# EAGLE design StackBreakoutConnection (EAGLE 9.1.0)
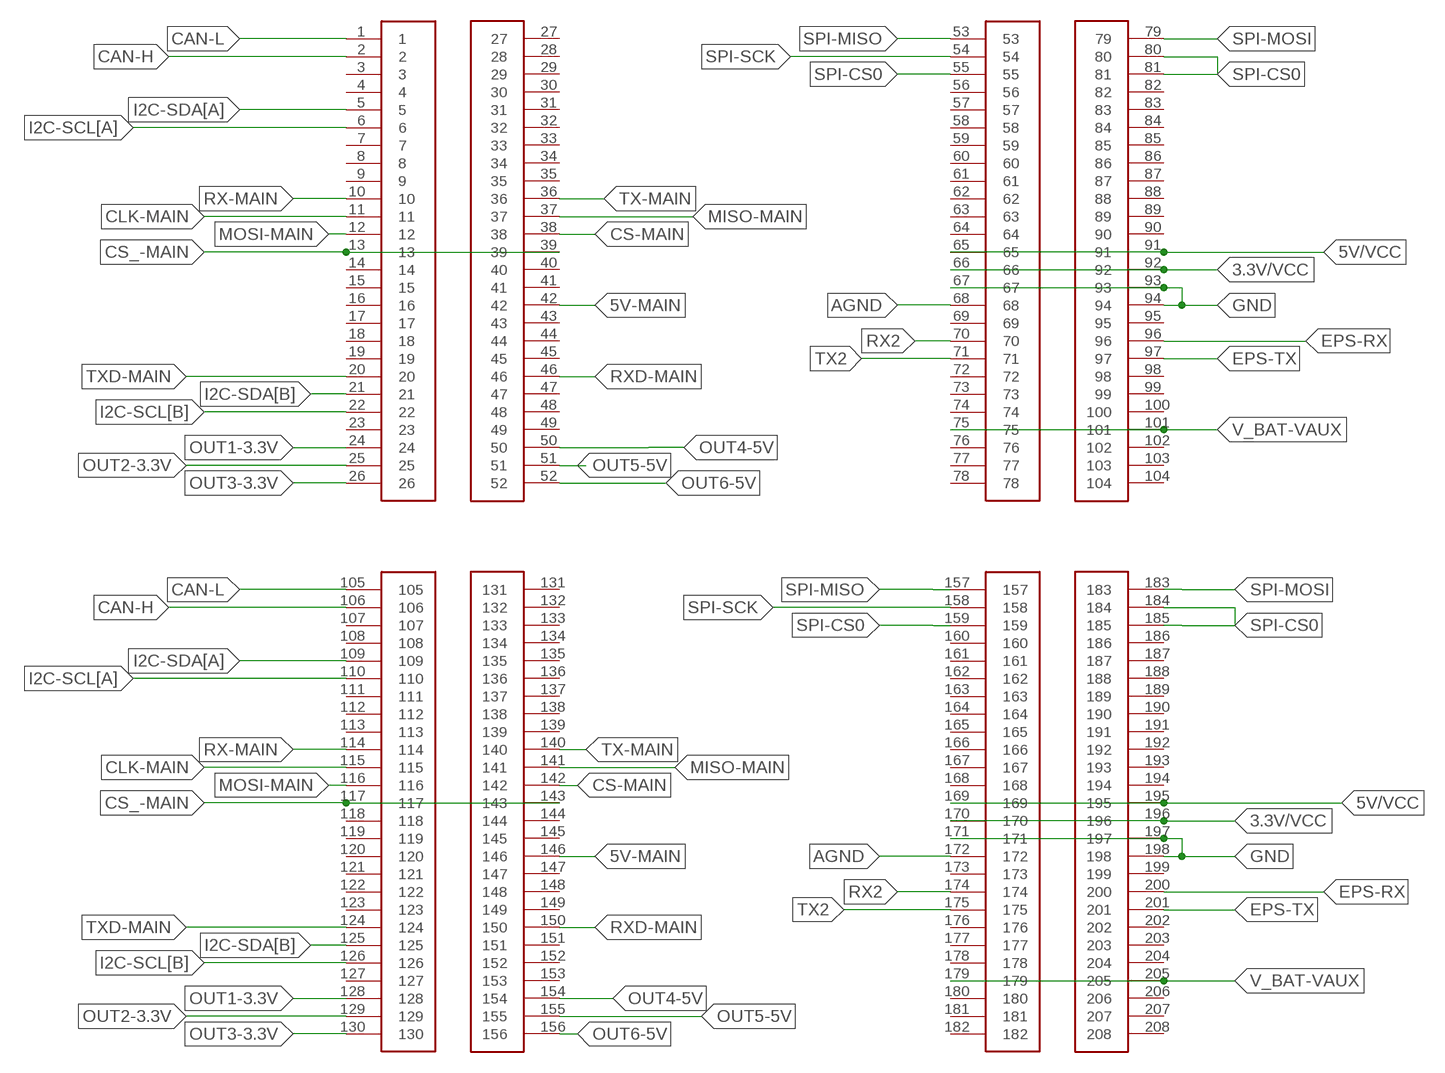
[diagram p0: schematic, sheet 1]

## Parts
U$1  SUCHAI_STACKBREAKOUT  [SUCHAI_STACKBREAKOUT]

## Nets
3.3V/VCC: U$1.66 U$1.92 U$1.170 U$1.196
5V-MAIN: U$1.42 U$1.146
5V/VCC: U$1.65 U$1.91 U$1.169 U$1.195
AGND: U$1.68 U$1.172
CAN-H: U$1.2 U$1.106
CAN-L: U$1.1 U$1.105
CLK-MAIN: U$1.11 U$1.115
CS-MAIN: U$1.38 U$1.142
CS_-MAIN: U$1.13 U$1.39 U$1.117 U$1.143
EPS-RX: U$1.96 U$1.200
EPS-TX: U$1.97 U$1.201
GND: U$1.67 U$1.93 U$1.94 U$1.171 U$1.197 U$1.198
I2C-SCL[A]: U$1.6 U$1.110
I2C-SCL[B]: U$1.22 U$1.126
I2C-SDA[A]: U$1.5 U$1.109
I2C-SDA[B]: U$1.21 U$1.125
MISO-MAIN: U$1.37 U$1.141
MOSI-MAIN: U$1.12 U$1.116
OUT1-3.3V: U$1.24 U$1.128
OUT2-3.3V: U$1.25 U$1.129
OUT3-3.3V: U$1.26 U$1.130
OUT4-5V: U$1.50 U$1.154
OUT5-5V: U$1.51 U$1.155
OUT6-5V: U$1.52 U$1.156
RX2: U$1.70 U$1.174
RX-MAIN: U$1.10 U$1.114
RXD-MAIN: U$1.46 U$1.150
SPI-CS0: U$1.55 U$1.80 U$1.81 U$1.159 U$1.184 U$1.185
SPI-MISO: U$1.53 U$1.157
SPI-MOSI: U$1.79 U$1.183
SPI-SCK: U$1.54 U$1.158
TX2: U$1.71 U$1.175
TX-MAIN: U$1.36 U$1.140
TXD-MAIN: U$1.20 U$1.124
V_BAT-VAUX: U$1.75 U$1.101 U$1.179 U$1.205
Unconnected: U$1.3 U$1.4 U$1.7 U$1.8 U$1.9 U$1.14 U$1.15 U$1.16 U$1.17 U$1.18 U$1.19 U$1.23 U$1.27 U$1.28 U$1.29 U$1.30 U$1.31 U$1.32 U$1.33 U$1.34 U$1.35 U$1.40 U$1.41 U$1.43 U$1.44 U$1.45 U$1.47 U$1.48 U$1.49 U$1.56 U$1.57 U$1.58 U$1.59 U$1.60 U$1.61 U$1.62 U$1.63 U$1.64 U$1.69 U$1.72 U$1.73 U$1.74 U$1.76 U$1.77 U$1.78 U$1.82 U$1.83 U$1.84 U$1.85 U$1.86 U$1.87 U$1.88 U$1.89 U$1.90 U$1.95 U$1.98 U$1.99 U$1.100 U$1.102 U$1.103 U$1.104 U$1.107 U$1.108 U$1.111 U$1.112 U$1.113 U$1.118 U$1.119 U$1.120 U$1.121 U$1.122 U$1.123 U$1.127 U$1.131 U$1.132 U$1.133 U$1.134 U$1.135 U$1.136 U$1.137 U$1.138 U$1.139 U$1.144 U$1.145 U$1.147 U$1.148 U$1.149 U$1.151 U$1.152 U$1.153 U$1.160 U$1.161 U$1.162 U$1.163 U$1.164 U$1.165 U$1.166 U$1.167 U$1.168 U$1.173 U$1.176 U$1.177 U$1.178 U$1.180 U$1.181 U$1.182 U$1.186 U$1.187 U$1.188 U$1.189 U$1.190 U$1.191 U$1.192 U$1.193 U$1.194 U$1.199 U$1.202 U$1.203 U$1.204 U$1.206 U$1.207 U$1.208

## Library data of the parts
U$1 = SUCHAI_PCB:SUCHAI_STACKBREAKOUT

## Board
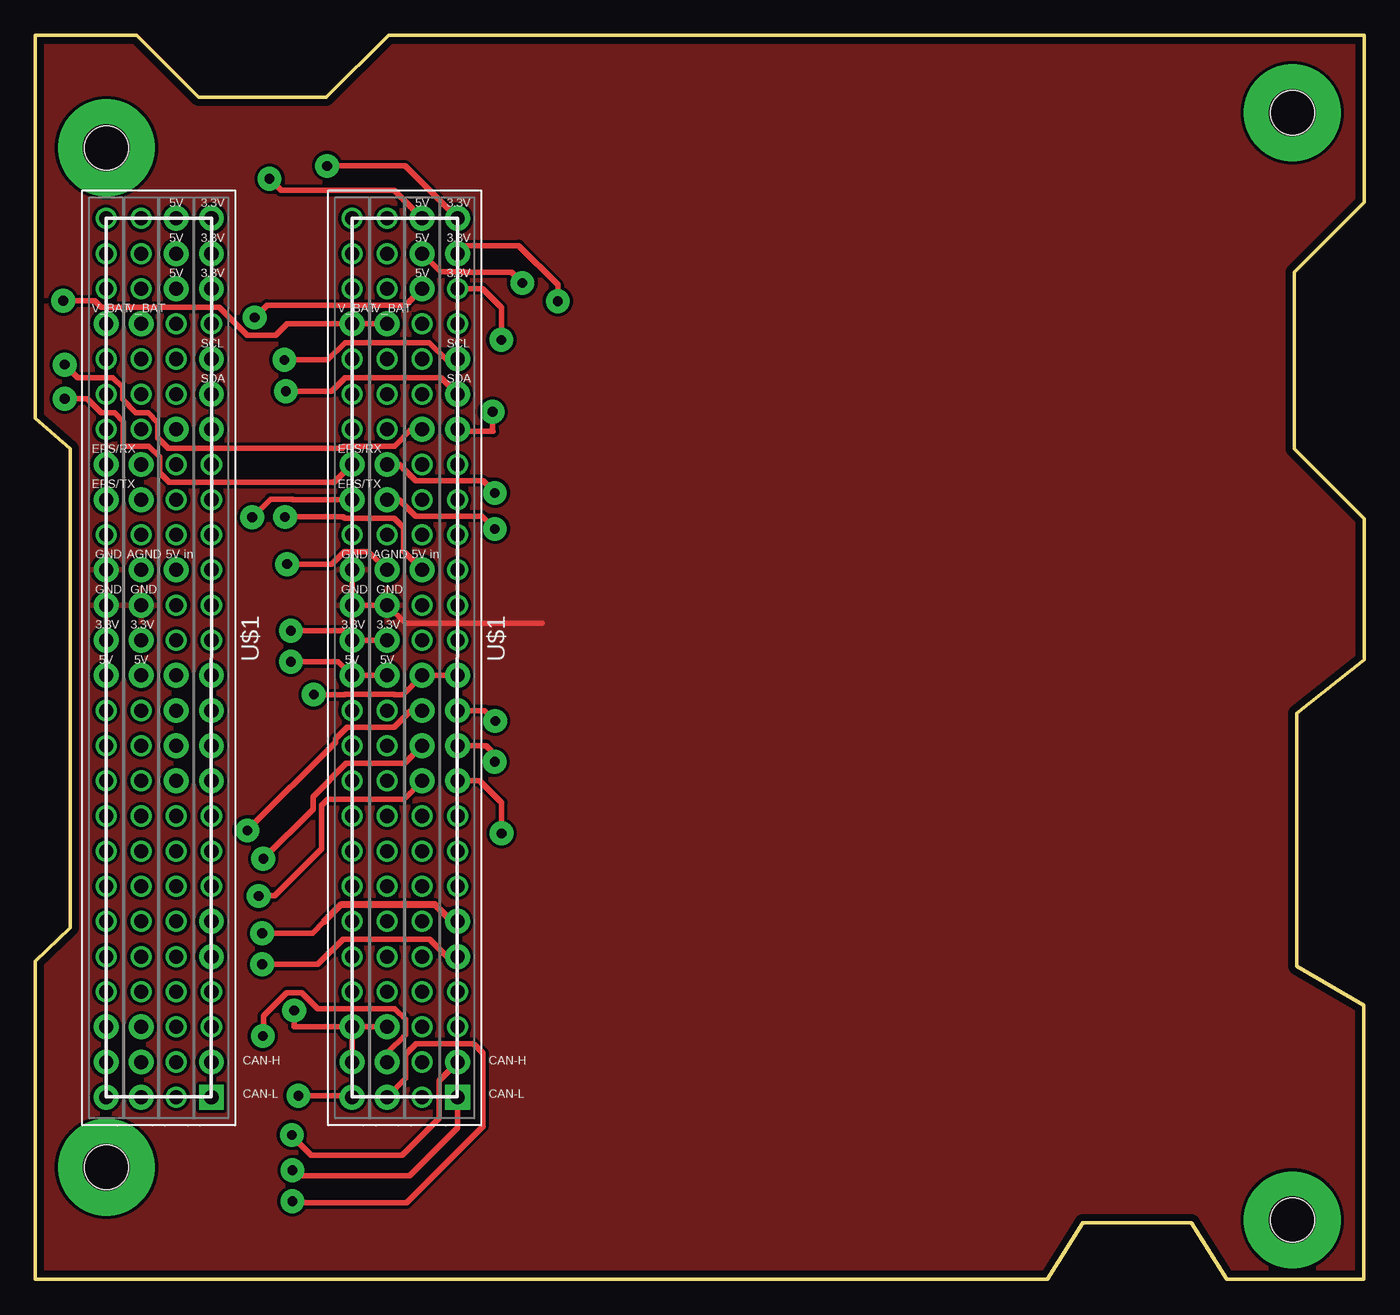
[diagram p1: board, top side]
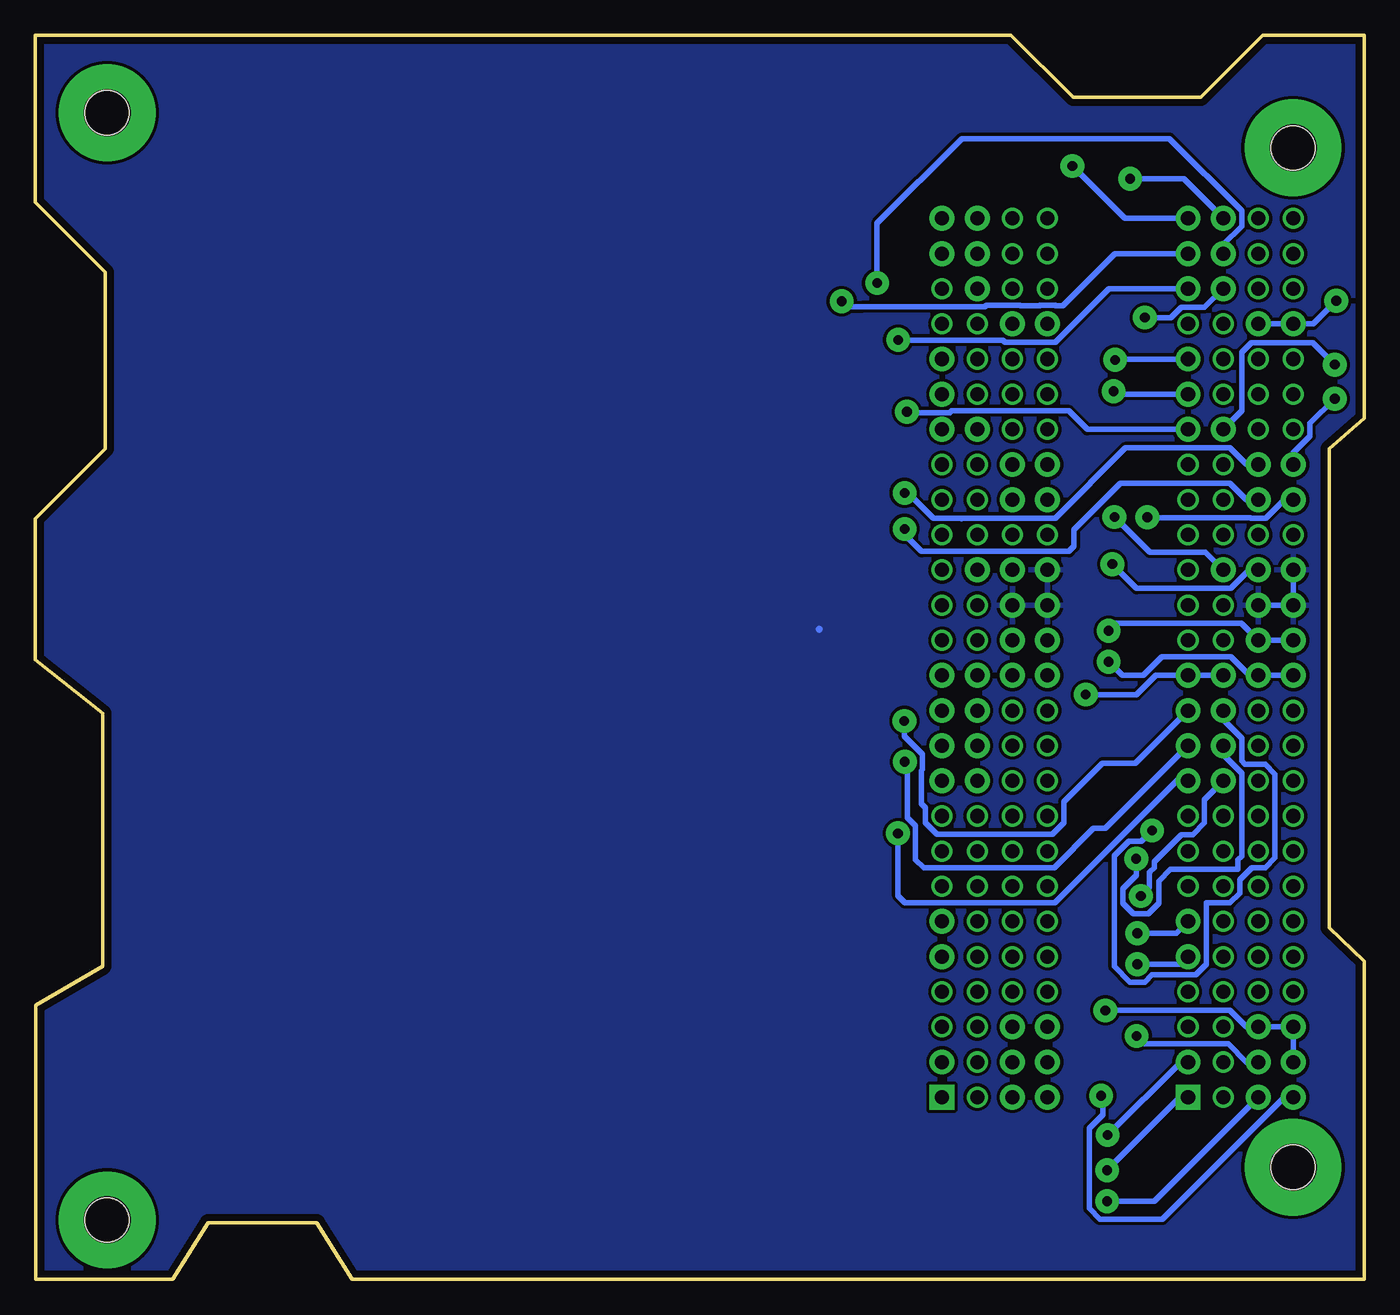
[diagram p2: board, bottom side, seen from below]

Size 96.16 x 90.01 mm. Coordinates in mm from the lower left corner, seen from the top.
Copper layers (1*16): Top 0.035mm / dielectric 1.5mm / Bottom 0.035mm
Design rules "default *": minimum track width 0.4mm, minimum drill 0.7mm, track to track 9mil, track to pad 9mil, pad to pad 9mil, via to via 9mil, smd to smd 9mil, copper to edge 20mil, drill to drill 6mil, minimum pad ring 10mil, minimum via ring 1.7mm, stop-mask expansion 4mil, vias tented up to drill 0mil, thermal gap 10mil

### Footprints (pad centres in the part's own frame; a part is rotated, then mirrored left to right if it is on the bottom)
SUCHAI_STACKBREAKOUT = drill 1.016 pad 1.8 square: 1 12.72,13.16; 105 30.5,13.16 | drill 1.016 pad 1.8: 2 12.72,15.7; 5 12.72,23.32; 6 12.72,25.86; 10 12.72,36.02; 11 12.72,38.56; 12 12.72,41.1; 13 12.72,43.64; 20 12.72,61.42; 21 12.72,63.96; 22 12.72,66.5; 24 12.72,71.58; 25 12.72,74.12; 26 12.72,76.66; 36 10.18,36.02; 37 10.18,38.56; 38 10.18,41.1; 39 10.18,43.64; 42 10.18,51.26; 46 10.18,61.42; 50 10.18,71.58; 51 10.18,74.12; 52 10.18,76.66; 53 7.64,13.16; 54 7.64,15.7; 55 7.64,18.24; 65 7.64,43.64; 66 7.64,46.18; 67 7.64,48.72; 68 7.64,51.26; 70 7.64,56.34; 71 7.64,58.88; 75 7.64,69.04; 79 5.1,13.16; 80 5.1,15.7; 81 5.1,18.24; 91 5.1,43.64; 92 5.1,46.18; 93 5.1,48.72; 94 5.1,51.26; 96 5.1,56.34; 97 5.1,58.88; 101 5.1,69.04; 106 30.5,15.7; 109 30.5,23.32; 110 30.5,25.86; 114 30.5,36.02; 115 30.5,38.56; 116 30.5,41.1; 117 30.5,43.64; 124 30.5,61.42; 125 30.5,63.96; 126 30.5,66.5; 129 30.5,74.12; 130 30.5,76.66; 140 27.96,36.02; 141 27.96,38.56; 142 27.96,41.1; 143 27.96,43.64; 146 27.96,51.26; 150 27.96,61.42; 154 27.96,71.58; 155 27.96,74.12; 156 27.96,76.66; 157 25.42,13.16; 158 25.42,15.7; 159 25.42,18.24; 169 25.42,43.64; 170 25.42,46.18; 171 25.42,48.72; 172 25.42,51.26; 174 25.42,56.34; 175 25.42,58.88; 179 25.42,69.04; 183 22.88,13.16; 184 22.88,15.7; 185 22.88,18.24; 195 22.88,43.64; 196 22.88,46.18; 197 22.88,48.72; 198 22.88,51.26; 200 22.88,56.34; 201 22.88,58.88; 205 22.88,69.04 | drill 1.016 pad 1.524: 3 12.72,18.24; 4 12.72,20.78; 7 12.72,28.4; 8 12.72,30.94; 9 12.72,33.48; 14 12.72,46.18; 15 12.72,48.72; 16 12.72,51.26; 17 12.72,53.8; 18 12.72,56.34; 19 12.72,58.88; 23 12.72,69.04; 27 10.18,13.16; 28 10.18,15.7; 29 10.18,18.24; 30 10.18,20.78; 31 10.18,23.32; 32 10.18,25.86; 33 10.18,28.4; 34 10.18,30.94; 35 10.18,33.48; 40 10.18,46.18; 41 10.18,48.72; 43 10.18,53.8; 44 10.18,56.34; 45 10.18,58.88; 47 10.18,63.96; 48 10.18,66.5; 49 10.18,69.04; 56 7.64,20.78; 57 7.64,23.32; 58 7.64,25.86; 59 7.64,28.4; 60 7.64,30.94; 61 7.64,33.48; 62 7.64,36.02; 63 7.64,38.56; 64 7.64,41.1; 69 7.64,53.8; 72 7.64,61.42; 73 7.64,63.96; 74 7.64,66.5; 76 7.64,71.58; 77 7.64,74.12; 78 7.64,76.66; 82 5.1,20.78; 83 5.1,23.32; 84 5.1,25.86; 85 5.1,28.4; 86 5.1,30.94; 87 5.1,33.48; 88 5.1,36.02; 89 5.1,38.56; 90 5.1,41.1; 95 5.1,53.8; 98 5.1,61.42; 99 5.1,63.96; 100 5.1,66.5; 102 5.1,71.58; 103 5.1,74.12; 104 5.1,76.66; 107 30.5,18.24; 108 30.5,20.78; 111 30.5,28.4; 112 30.5,30.94; 113 30.5,33.48; 118 30.5,46.18; 119 30.5,48.72; 120 30.5,51.26; 121 30.5,53.8; 122 30.5,56.34; 123 30.5,58.88; 127 30.5,69.04; 128 30.5,71.58; 131 27.96,13.16; 132 27.96,15.7; 133 27.96,18.24; 134 27.96,20.78; 135 27.96,23.32; 136 27.96,25.86; 137 27.96,28.4; 138 27.96,30.94; 139 27.96,33.48; 144 27.96,46.18; 145 27.96,48.72; 147 27.96,53.8; 148 27.96,56.34; 149 27.96,58.88; 151 27.96,63.96; 152 27.96,66.5; 153 27.96,69.04; 160 25.42,20.78; 161 25.42,23.32; 162 25.42,25.86; 163 25.42,28.4; 164 25.42,30.94; 165 25.42,33.48; 166 25.42,36.02; 167 25.42,38.56; 168 25.42,41.1; 173 25.42,53.8; 176 25.42,61.42; 177 25.42,63.96; 178 25.42,66.5; 180 25.42,71.58; 181 25.42,74.12; 182 25.42,76.66; 186 22.88,20.78; 187 22.88,23.32; 188 22.88,25.86; 189 22.88,28.4; 190 22.88,30.94; 191 22.88,33.48; 192 22.88,36.02; 193 22.88,38.56; 194 22.88,41.1; 199 22.88,53.8; 202 22.88,61.42; 203 22.88,63.96; 204 22.88,66.5; 206 22.88,71.58; 207 22.88,74.12; 208 22.88,76.66 | drill 3.4 pad 7: P$1 5.13,8.1; P$2 5.13,81.76; P$3 90.86,4.29; P$4 90.86,84.3 | hole 3.2: 5.13,8.1; 90.86,4.29; 90.86,84.3; 5.13,81.76

### Placement (x,y rotation side)
U$1  0.06,0.06 0 top

### Tracks (layer width: path | path; a pad name or v marks a point on that pad's centre or on a via)
3.3V/VCC  (via drill 0.7)
  Top 0.4: U$1.170 U$1.196 22.26,46.93 v18.52,46.93
  Bottom 0.4: U$1.92 U$1.66 8.93,47.47 17.98,47.47 v18.52,46.93
5V-MAIN  (via drill 0.7)
  Top 0.4: v18.11,55.16 22.31,55.16 22.41,55.05 25.98,55.05 26.67,54.36 26.67,52.67 U$1.146
  Bottom 0.4: v18.11,55.16 15.56,52.61 11.53,52.61 U$1.42
5V/VCC  (via drill 0.7)
  Top 0.4: U$1.169 U$1.195 21.96,44.69 v18.53,44.69
  Bottom 0.4: U$1.91 U$1.65 8.36,43.7 9.69,45.03 14.68,45.03 16.01,43.7 17.54,43.7 v18.53,44.69
AGND  (via drill 0.7)
  Top 0.4: v18.26,51.74 21.48,51.74 22.39,52.65 24.15,52.65 U$1.172
  Bottom 0.4: U$1.68 8.36,51.32 9.69,49.99 16.51,49.99 v18.26,51.74
CAN-H  (via drill 0.7)
  Top 0.4: U$1.106 29.23,14.43 29.23,11.7 26.57,9.04 20,9.04 18.59,10.45 v18.59,10.5
  Bottom 0.4: v18.59,10.5 13.32,15.76 U$1.2
CAN-L  (via drill 0.7)
  Top 0.4: U$1.105 30.56,11.02 27.1,7.55 19.04,7.55 v18.64,7.94
  Bottom 0.4: U$1.1 13.36,13.22 v18.64,7.94
CLK-MAIN  (via drill 0.7)
  Top 0.4: v33.26,37.46 33.26,38 32.64,38.62 U$1.115
  Bottom 0.4: v33.26,37.46 33.08,37.28 33.08,33.43 32.47,32.82 32.47,30.39 31.89,29.81 22.45,29.81 19.62,32.64 18.76,32.64 U$1.11
CS-MAIN  (via drill 0.7)
  Top 0.4: v15.38,32.5 21.75,38.88 21.75,39.12 22.61,39.97 25.98,39.97 27.17,41.16 U$1.142
  Bottom 0.4: U$1.38 10.24,40.5 8.91,39.17 8.91,37.52 8.67,37.27 7.21,37.27 6.51,36.58 6.51,30.51 7.21,29.81 8.19,29.81 9.05,28.95 9.05,27.97 9.75,27.27 11.45,27.27 11.45,22.83 12.23,22.05 15.4,22.05 15.91,21.55 16.98,21.55 18.11,22.68 18.11,30.68 17.06,31.73 16.15,31.73 v15.38,32.5
CS_-MAIN  (via drill 0.7)
  Top 0.4: U$1.117 U$1.143 26.64,42.32 26.01,42.32 25.98,42.35 22.45,42.35 22.41,42.32 v20.18,42.32
  Bottom 0.4: U$1.39 U$1.13 15.12,43.7 16.51,42.32 v20.18,42.32
EPS-RX  (via drill 0.7)
  Top 0.4: U$1.200 18.68,56.4 18.64,56.44 17.05,56.44 v15.73,55.12
  Bottom 0.4: U$1.96 5.82,56.4 7.15,55.07 8.25,55.07 8.27,55.09 15.7,55.09 v15.73,55.12
EPS-TX  (via drill 0.7)
  Top 0.4: v2.18,63.7 3.8,63.7 4.83,62.67 5.78,62.67 6.41,62.05 6.41,60.27 8.25,60.27 9.03,59.49 9.03,58.36 9.74,57.65 21.65,57.65 U$1.201
  Bottom 0.4: v2.18,63.7 3.97,61.91 3.97,60.99 5.16,59.8 U$1.97
GND
  Top 0.4: U$1.197 U$1.171 26.81,47.46 36.69,47.46 | U$1.197 U$1.198 | 22.52,49.21 U$1.197
  Bottom 0.4: U$1.67 U$1.93 U$1.94
  Bottom 0.5: 39.45,47.03 39.43,47.05
  pour Bottom: 0.1,89.92 7.45,89.92 7.45,89.98 11.85,85.58 11.85,85.32 21.02,85.32 21.17,85.47 25.57,89.87 26.09,89.87 96.08,89.87 96.13,89.82 96.13,77.96 96.03,77.86 91.01,72.84 91.01,59.94 96.19,54.77 96.19,44.77 91.37,39.96 91.37,22.56 96.13,19.82 96.13,0.09 86.19,0.09 83.55,4.18 75.68,4.18 73.25,0.09 -0.03,0.09 -0.03,22.91 2.54,25.48 2.54,25.49 2.54,60.04 2.58,60.07 0.09,62.57 0.09,89.93 0.09,89.93
  pour Top: 0.06,0.06 73.72,0.06 76.26,3.87 83.88,3.87 86.42,0.06 96.58,0.06 96.58,20.38 91.5,22.92 91.5,40.7 96.58,44.51 96.58,54.67 91.5,59.75 91.5,72.45 96.58,77.53 96.58,90.23 25.46,90.23 20.38,85.15 11.49,85.15 7.68,90.23 0.06,90.23 0.06,62.29 2.6,59.75 2.6,25.46 0.06,22.92
I2C-SCL[A]  (via drill 0.7)
  Top 0.4: v16.45,25.08 20.09,25.08 20.94,25.92
  Top 0.5: U$1.110 30.15,25.92 28.92,27.16 22.17,27.16 20.94,25.92
  Bottom 0.4: U$1.6 13.63,25.08 v16.45,25.08
I2C-SCL[B]  (via drill 0.7)
  Top 0.4: U$1.126 30.5,66.5 29.77,66.5 28.52,67.75 22.45,67.75 21.2,66.5 v18.06,66.5
  Bottom 0.4: U$1.22 18,66.56 v18.06,66.5
I2C-SDA[A]  (via drill 0.7)
  Top 0.4: U$1.109 29.82,23.38 28.56,24.65 22.29,24.65 20.48,22.83 v16.45,22.83
  Bottom 0.4: U$1.5 13.33,22.83 v16.45,22.83
I2C-SDA[B]  (via drill 0.7)
  Top 0.4: v18.17,64.24 21.48,64.24 22.45,65.21 29.37,65.21 U$1.125
  Bottom 0.4: U$1.21 17.95,64.02 v18.17,64.24
MISO-MAIN  (via drill 0.7)
  Top 0.4: v16.53,30.45 20.13,34.04 20.13,34.95 22.53,37.35 26.75,37.35 U$1.141
  Bottom 0.4: U$1.37 10.24,37.96 8.91,36.63 8.91,30.65 9.2,30.36 9.2,29.69 14.06,29.69 14.91,28.84 14.91,27.23 15.67,26.48 16.73,26.48 17.49,27.23 17.49,28.3 16.53,29.25 v16.53,30.45
MOSI-MAIN  (via drill 0.7)
  Top 0.4: v33.29,40.41 32.54,41.16 U$1.116
  Bottom 0.4: U$1.12 16.58,37.37 18.96,37.37 21.75,34.58 21.75,33.05 22.59,32.22 30.92,32.22 31.75,33.05 31.75,34.13 32.07,34.45 32.07,36.83 31.97,36.93 31.97,38 33.29,39.32 v33.29,40.41
OUT1-3.3V  (via drill 0.7)
  Top 0.4: v33.74,67.95 33.74,70.28 32.38,71.64 U$1.128
  Bottom 0.4: U$1.24 18.52,71.64 22.39,67.77 26.03,67.77 26.17,67.91 33.7,67.91 v33.74,67.95
OUT2-3.3V  (via drill 0.7)
  Top 0.4: U$1.129 31.14,74.76 34.99,74.76 37.82,71.92 v37.82,70.74
  Bottom 0.4: U$1.25 18.07,74.18 21.83,70.42 22.38,70.42 22.39,70.43 23.49,70.43 23.51,70.42 24.92,70.42 24.93,70.43 27.36,70.43 27.46,70.33 36.37,70.33 37.41,70.33 v37.82,70.74
OUT3-3.3V  (via drill 0.7)
  Top 0.4: v21.15,80.52 26.77,80.52 U$1.130
  Bottom 0.4: U$1.26 17.35,76.72 v21.15,80.52
OUT4-5V  (via drill 0.7)
  Top 0.4: v15.9,69.56 16.8,70.46 22.45,70.46 22.45,70.45 26.83,70.45 U$1.154
  Bottom 0.4: U$1.50 11.59,70.29 13.28,70.29 14.01,69.56 v15.9,69.56
OUT5-5V  (via drill 0.7)
  Top 0.4: U$1.155 29.35,72.85 31.04,72.85 31.06,72.83 34.48,72.83 v35.26,72.05
  Bottom 0.4: U$1.51 10.24,74.84 8.91,76.17 8.91,77.27 14.14,82.5 29.13,82.5 35.26,76.37 v35.26,72.05
OUT6-5V  (via drill 0.7)
  Top 0.4: v16.98,79.58 17.81,78.76 25.99,78.76 U$1.156
  Bottom 0.4: U$1.52 13.1,79.58 v16.98,79.58
RX2  (via drill 0.7)
  Top 0.4: v33.27,54.29 32.35,55.21 27.53,55.21 26.34,56.4 U$1.174
  Bottom 0.4: U$1.70 8.56,56.4 9.75,57.59 17.66,57.59 21.03,54.23 21.03,53.03 21.38,52.67 32.05,52.67 33.27,53.9 v33.27,54.29
RX-MAIN  (via drill 0.7)
  Top 0.4: v33.76,32.29 33.76,34.5 32.18,36.08 U$1.114
  Bottom 0.4: v33.76,32.29 33.75,32.28 33.75,27.77 33.26,27.29 22.41,27.29 13.49,36.21 12.91,36.21 U$1.10
RXD-MAIN  (via drill 0.7)
  Top 0.4: v2.18,66.16 3.12,65.21 5.66,65.21 6.35,64.52 6.35,63.65 7.33,62.67 8.2,62.67 8.89,61.98 8.89,60.88 9.67,60.11 9.72,60.11 9.75,60.13 22.26,60.13 22.39,60.27 26.02,60.27 27.23,61.48 U$1.150
  Bottom 0.4: v2.18,66.16 3.78,67.75 8.2,67.75 8.89,67.06 8.89,62.83 U$1.46
SPI-CS0  (via drill 0.7)
  Top 0.4: U$1.185 23.12,18.3 | 23.12,18.3 U$1.159 | 22.88,18.24 U$1.185 | v18.76,19.49 18.76,18.3 23.12,18.3 | U$1.185 U$1.184
  Bottom 0.4: v18.76,19.49 9.75,19.49 8.56,18.3 U$1.55 U$1.81 U$1.80 | v18.76,19.49
SPI-MISO  (via drill 0.7)
  Top 0.4: U$1.157 25.47,13.24 26.82,14.58 26.82,16.33 27.58,17.09 31.72,17.09 32.41,16.4 32.41,11.11 26.89,5.59 18.75,5.59 v18.64,5.71
  Bottom 0.4: U$1.53 15.22,5.71 v18.64,5.71
SPI-MOSI  (via drill 0.7)
  Top 0.4: v19.06,13.33 22.84,13.33 U$1.183
  Bottom 0.4: v19.06,13.33 18.96,13.22 18.96,11.95 19.93,10.98 19.93,5.18 19.17,4.42 14.63,4.42 5.82,13.22 U$1.79
SPI-SCK  (via drill 0.7)
  Top 0.4: U$1.158 25.48,16.42 26.81,17.75 26.81,18.85 26.03,19.63 20.44,19.63 19.3,20.78 18.23,20.78 16.55,19.1 16.55,17.69 v16.5,17.65
  Bottom 0.4: U$1.54 8.56,15.76 9.89,17.09 15.95,17.09 v16.5,17.65
TX2  (via drill 0.7)
  Top 0.4: v33.27,56.89 32.41,57.75 27.53,57.75 26.34,58.94 U$1.175
  Bottom 0.4: U$1.71 8.56,58.94 9.76,60.14 17.33,60.14 22.39,55.07 29.13,55.07 29.17,55.03 29.2,55.06 31.21,55.06 33.03,56.89 v33.27,56.89
TX-MAIN  (via drill 0.7)
  Top 0.4: U$1.140 26.71,34.77 21.19,34.77 20.76,34.34 20.76,31.18 17.34,27.76 v16.2,27.76
  Bottom 0.4: U$1.36 11.59,34.73 11.59,33.05 12.45,32.19 13.28,32.19 15.23,30.24 15.23,29.81 15.53,29.5 15.55,29.49 | v16.2,27.76 15.57,28.39 15.57,29.49 15.55,29.49 | 15.55,29.49 15.56,29.48
TXD-MAIN  (via drill 0.7)
  Top 0.4: v33.11,62.75 33.11,61.37 33.15,61.33 30.72,61.33 U$1.124
  Bottom 0.4: U$1.20 20.06,61.48 21.39,62.81 29.9,62.81 30.01,62.69 33.05,62.69 v33.11,62.75
V_BAT-VAUX  (via drill 0.7)
  Top 0.4: U$1.179 U$1.205 18.27,69.1 17.44,68.27 15.37,68.27 13.33,70.31 4.81,70.31 4.35,70.77 v2.06,70.77
  Bottom 0.4: U$1.75 U$1.101 3.73,69.1 v2.06,70.77